# EAGLE schematic DR (EAGLE 9.4.2)

## Sheet 1 of 5
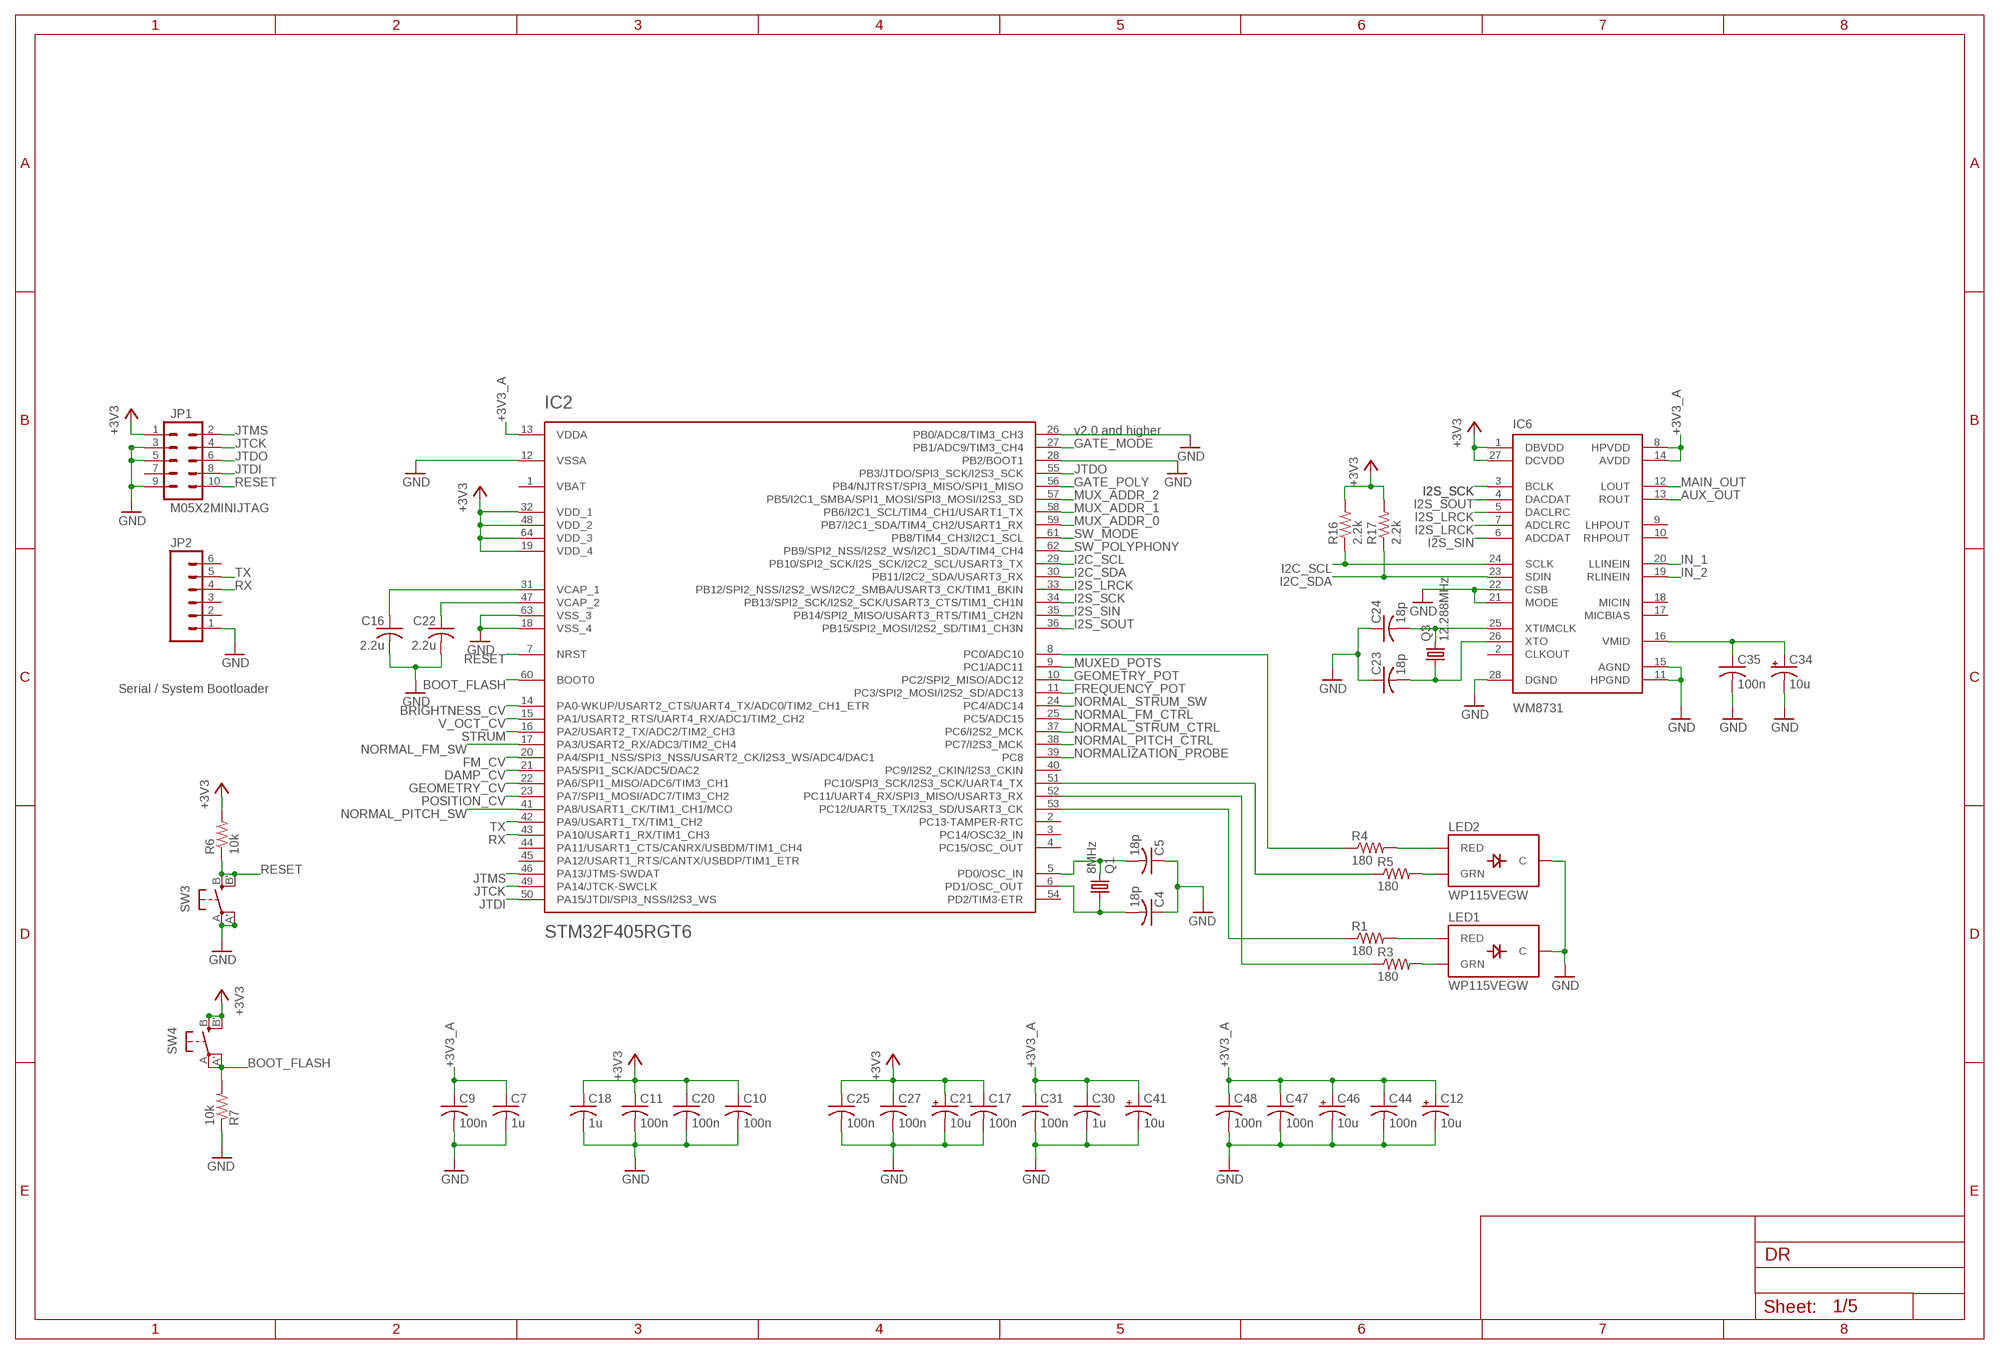
[diagram p0: schematic, sheet 1]

### Parts
C4  18p  C-USC0603  [C0603]
C5  18p  C-USC0603  [C0603]
C7  1u  C-USC0603  [C0603]
C9  100n  C-USC0603  [C0603]
C10  100n  C-USC0603  [C0603]
C11  100n  C-USC0603  [C0603]
C12  10u  CPOL-USA  [PANASONIC_A]
C16  2.2u  C-USC0805  [C0805]
C17  100n  C-USC0603  [C0603]
C18  1u  C-USC0603  [C0603]
C20  100n  C-USC0603  [C0603]
C21  10u  CPOL-USA  [PANASONIC_A]
C22  2.2u  C-USC0805  [C0805]
C23  18p  C-USC0603  [C0603]
C24  18p  C-USC0603  [C0603]
C25  100n  C-USC0603  [C0603]
C27  100n  C-USC0603  [C0603]
C30  1u  C-USC0603  [C0603]
C31  100n  C-USC0603  [C0603]
C34  10u  CPOL-USA  [PANASONIC_A]
C35  100n  C-USC0603  [C0603]
C41  10u  CPOL-USA  [PANASONIC_A]
C44  100n  C-USC0603  [C0603]
C46  10u  CPOL-USA  [PANASONIC_A]
C47  100n  C-USC0603  [C0603]
C48  100n  C-USC0603  [C0603]
IC2  STM32F405RGT6  STM32F20X  [TQFP-10X10-64]
IC6  WM8731  [SSOP28]
JP1  M05X2MINIJTAG  [2X5-1.27]
JP2  M06SIP  [1X06]
LED1  WP115VEGW  LED-BICOLOR-THROUGHHOLE  [LED-BICOLOR-THROUGHHOLE]
LED2  WP115VEGW  LED-BICOLOR-THROUGHHOLE  [LED-BICOLOR-THROUGHHOLE]
Q1  8MHz  CRYSTALHC49UP  [HC49UP]
Q3  12.288MHz  CRYSTALHC49UP  [HC49UP]
R1  180  R-US_R0603  [R0603]
R3  180  R-US_R0603  [R0603]
R4  180  R-US_R0603  [R0603]
R5  180  R-US_R0603  [R0603]
R6  10k  R-US_R0603  [R0603]
R7  10k  R-US_R0603  [R0603]
R16  2.2k  R-US_R0603  [R0603]
R17  2.2k  R-US_R0603  [R0603]
SW3  EVQQ2  [EVQ-Q2]
SW4  EVQQ2  [EVQ-Q2]

### Nets
+3V3: C10.1 C11.1 C17.1 C18.1 C20.1 C21.+ C25.1 C27.1 IC2.19(VDD_4) IC2.32(VDD_1) IC2.48(VDD_2) IC2.64(VDD_3) IC6.1(DBVDD) IC6.27(DCVDD) JP1.1 R6.2 R16.2 R17.2 SW4.B'(S1) SW4.B(S) ; also sheet 2,4,5
+3V3_A: C7.1 C9.1 C12.+ C30.1 C31.1 C41.+ C44.1 C46.+ C47.1 C48.1 IC2.13(VDDA) IC6.8(HPVDD) IC6.14(AVDD) ; also sheet 2,3,4,5
AUX_OUT: IC6.13(ROUT) ; also sheet 4
BOOT_FLASH: IC2.60(BOOT0) R7.2 SW4.A'(P1) SW4.A(P)
BRIGHTNESS_CV: IC2.14(PA0-WKUP/USART2_CTS/UART4_TX/ADC0/TIM2_CH1_ETR) ; also sheet 3
DAMP_CV: IC2.21(PA5/SPI1_SCK/ADC5/DAC2) ; also sheet 3
FM_CV: IC2.20(PA4/SPI1_NSS/SPI3_NSS/USART2_CK/I2S3_WS/ADC4/DAC1) ; also sheet 3
FREQUENCY_POT: IC2.11(PC3/SPI2_MOSI/I2S2_SD/ADC13) ; also sheet 2
GATE_MODE: IC2.27(PB1/ADC9/TIM3_CH4) ; also sheet 2
GATE_POLY: IC2.56(PB4/NJTRST/SPI3_MISO/SPI1_MISO) ; also sheet 2
GEOMETRY_CV: IC2.22(PA6/SPI1_MISO/ADC6/TIM3_CH1) ; also sheet 3
GEOMETRY_POT: IC2.10(PC2/SPI2_MISO/ADC12) ; also sheet 2
GND: C4.1 C5.1 C7.2 C9.2 C10.2 C11.2 C12.- C16.2 C17.2 C18.2 C20.2 C21.- C22.2 C23.1 C24.1 C25.2 C27.2 C30.2 C31.2 C34.- C35.2 C41.- C44.2 C46.- C47.2 C48.2 IC2.12(VSSA) IC2.18(VSS_4) IC2.26(PB0/ADC8/TIM3_CH3) IC2.28(PB2/BOOT1) IC2.63(VSS_3) IC6.11(HPGND) IC6.15(AGND) IC6.21(MODE) IC6.22(CSB) IC6.28(DGND) JP1.3 JP1.5 JP1.9 JP2.1 LED1.2(C) LED2.2(C) R7.1 SW3.A'(P1) SW3.A(P) ; also sheet 2,3,4,5
I2C_SCL: IC2.29(PB10/SPI2_SCK/I2S_SCK/I2C2_SCL/USART3_TX) IC6.24(SCLK) R16.1
I2C_SDA: IC2.30(PB11/I2C2_SDA/USART3_RX) IC6.23(SDIN) R17.1
I2S_LRCK: IC2.33(PB12/SPI2_NSS/I2S2_WS/I2C2_SMBA/USART3_CK/TIM1_BKIN) IC6.5(DACLRC) IC6.7(ADCLRC)
I2S_SCK: IC2.34(PB13/SPI2_SCK/I2S2_SCK/USART3_CTS/TIM1_CH1N) IC6.3(BCLK)
I2S_SIN: IC2.35(PB14/SPI2_MISO/USART3_RTS/TIM1_CH2N) IC6.6(ADCDAT)
I2S_SOUT: IC2.36(PB15/SPI2_MOSI/I2S2_SD/TIM1_CH3N) IC6.4(DACDAT)
IN_1: IC6.20(LLINEIN) ; also sheet 4
IN_2: IC6.19(RLINEIN) ; also sheet 4
JTCK: IC2.49(PA14/JTCK-SWCLK) JP1.4
JTDI: IC2.50(PA15/JTDI/SPI3_NSS/I2S3_WS) JP1.8
JTDO: IC2.55(PB3/JTDO/SPI3_SCK/I2S3_SCK) JP1.6
JTMS: IC2.46(PA13/JTMS-SWDAT) JP1.2
MAIN_OUT: IC6.12(LOUT) ; also sheet 4
MUX_ADDR_0: IC2.59(PB7/I2C1_SDA/TIM4_CH2/USART1_RX) ; also sheet 2
MUX_ADDR_1: IC2.58(PB6/I2C1_SCL/TIM4_CH1/USART1_TX) ; also sheet 2
MUX_ADDR_2: IC2.57(PB5/I2C1_SMBA/SPI1_MOSI/SPI3_MOSI/I2S3_SD) ; also sheet 2
MUXED_POTS: IC2.9(PC1/ADC11) ; also sheet 2
N$7: C5.2 IC2.5(PD0/OSC_IN) Q1.2
N$8: C4.2 IC2.6(PD1/OSC_OUT) Q1.1
N$12: LED1.3(RED) R1.2
N$13: C22.1 IC2.47(VCAP_2)
N$17: C34.+ C35.1 IC6.16(VMID)
N$19: C16.1 IC2.31(VCAP_1)
N$22: LED1.1(GRN) R3.2
N$27: LED2.3(RED) R4.2
N$35: LED2.1(GRN) R5.2
N$37: IC2.52(PC11/UART4_RX/SPI3_MISO/USART3_RX) R3.1
N$40: IC2.8(PC0/ADC10) R4.1
N$41: C24.2 IC6.25(XTI/MCLK) Q3.2
N$42: C23.2 IC6.26(XTO) Q3.1
N$43: IC2.53(PC12/UART5_TX/I2S3_SD/USART3_CK) R1.1
N$44: IC2.51(PC10/SPI3_SCK/I2S3_SCK/UART4_TX) R5.1
NORMAL_FM_CTRL: IC2.25(PC5/ADC15) ; also sheet 4
NORMAL_FM_SW: IC2.17(PA3/USART2_RX/ADC3/TIM2_CH4) ; also sheet 4
NORMAL_PITCH_CTRL: IC2.38(PC7/I2S3_MCK) ; also sheet 4
NORMAL_PITCH_SW: IC2.41(PA8/USART1_CK/TIM1_CH1/MCO) ; also sheet 4
NORMAL_STRUM_CTRL: IC2.37(PC6/I2S2_MCK) ; also sheet 4
NORMAL_STRUM_SW: IC2.24(PC4/ADC14) ; also sheet 4
NORMALIZATION_PROBE: IC2.39(PC8) ; also sheet 4
POSITION_CV: IC2.23(PA7/SPI1_MOSI/ADC7/TIM3_CH2) ; also sheet 3
RESET: IC2.7(NRST) JP1.10 R6.1 SW3.B'(S1) SW3.B(S)
RX: IC2.43(PA10/USART1_RX/TIM1_CH3) JP2.4
STRUM: IC2.16(PA2/USART2_TX/ADC2/TIM2_CH3) ; also sheet 4
SW_MODE: IC2.61(PB8/TIM4_CH3/I2C1_SCL) ; also sheet 2
SW_POLYPHONY: IC2.62(PB9/SPI2_NSS/I2S2_WS/I2C1_SDA/TIM4_CH4) ; also sheet 2
TX: IC2.42(PA9/USART1_TX/TIM1_CH2) JP2.5
V_OCT_CV: IC2.15(PA1/USART2_RTS/UART4_RX/ADC1/TIM2_CH2) ; also sheet 3
Unconnected: IC2.2(PC13-TAMPER-RTC) IC2.3(PC14/OSC32_IN) IC2.4(PC15/OSC_OUT) IC2.40(PC9/I2S2_CKIN/I2S3_CKIN) IC2.44(PA11/USART1_CTS/CANRX/USBDM/TIM1_CH4) IC2.45(PA12/USART1_RTS/CANTX/USBDP/TIM1_ETR) IC2.54(PD2/TIM3-ETR) IC6.2(CLKOUT) IC6.9(LHPOUT) IC6.10(RHPOUT) IC6.17(MICBIAS) IC6.18(MICIN) JP1.7 JP2.2 JP2.3 JP2.6

### Notes on the sheet
- v2.0 and higher
- Serial / System Bootloader

## Sheet 2 of 5
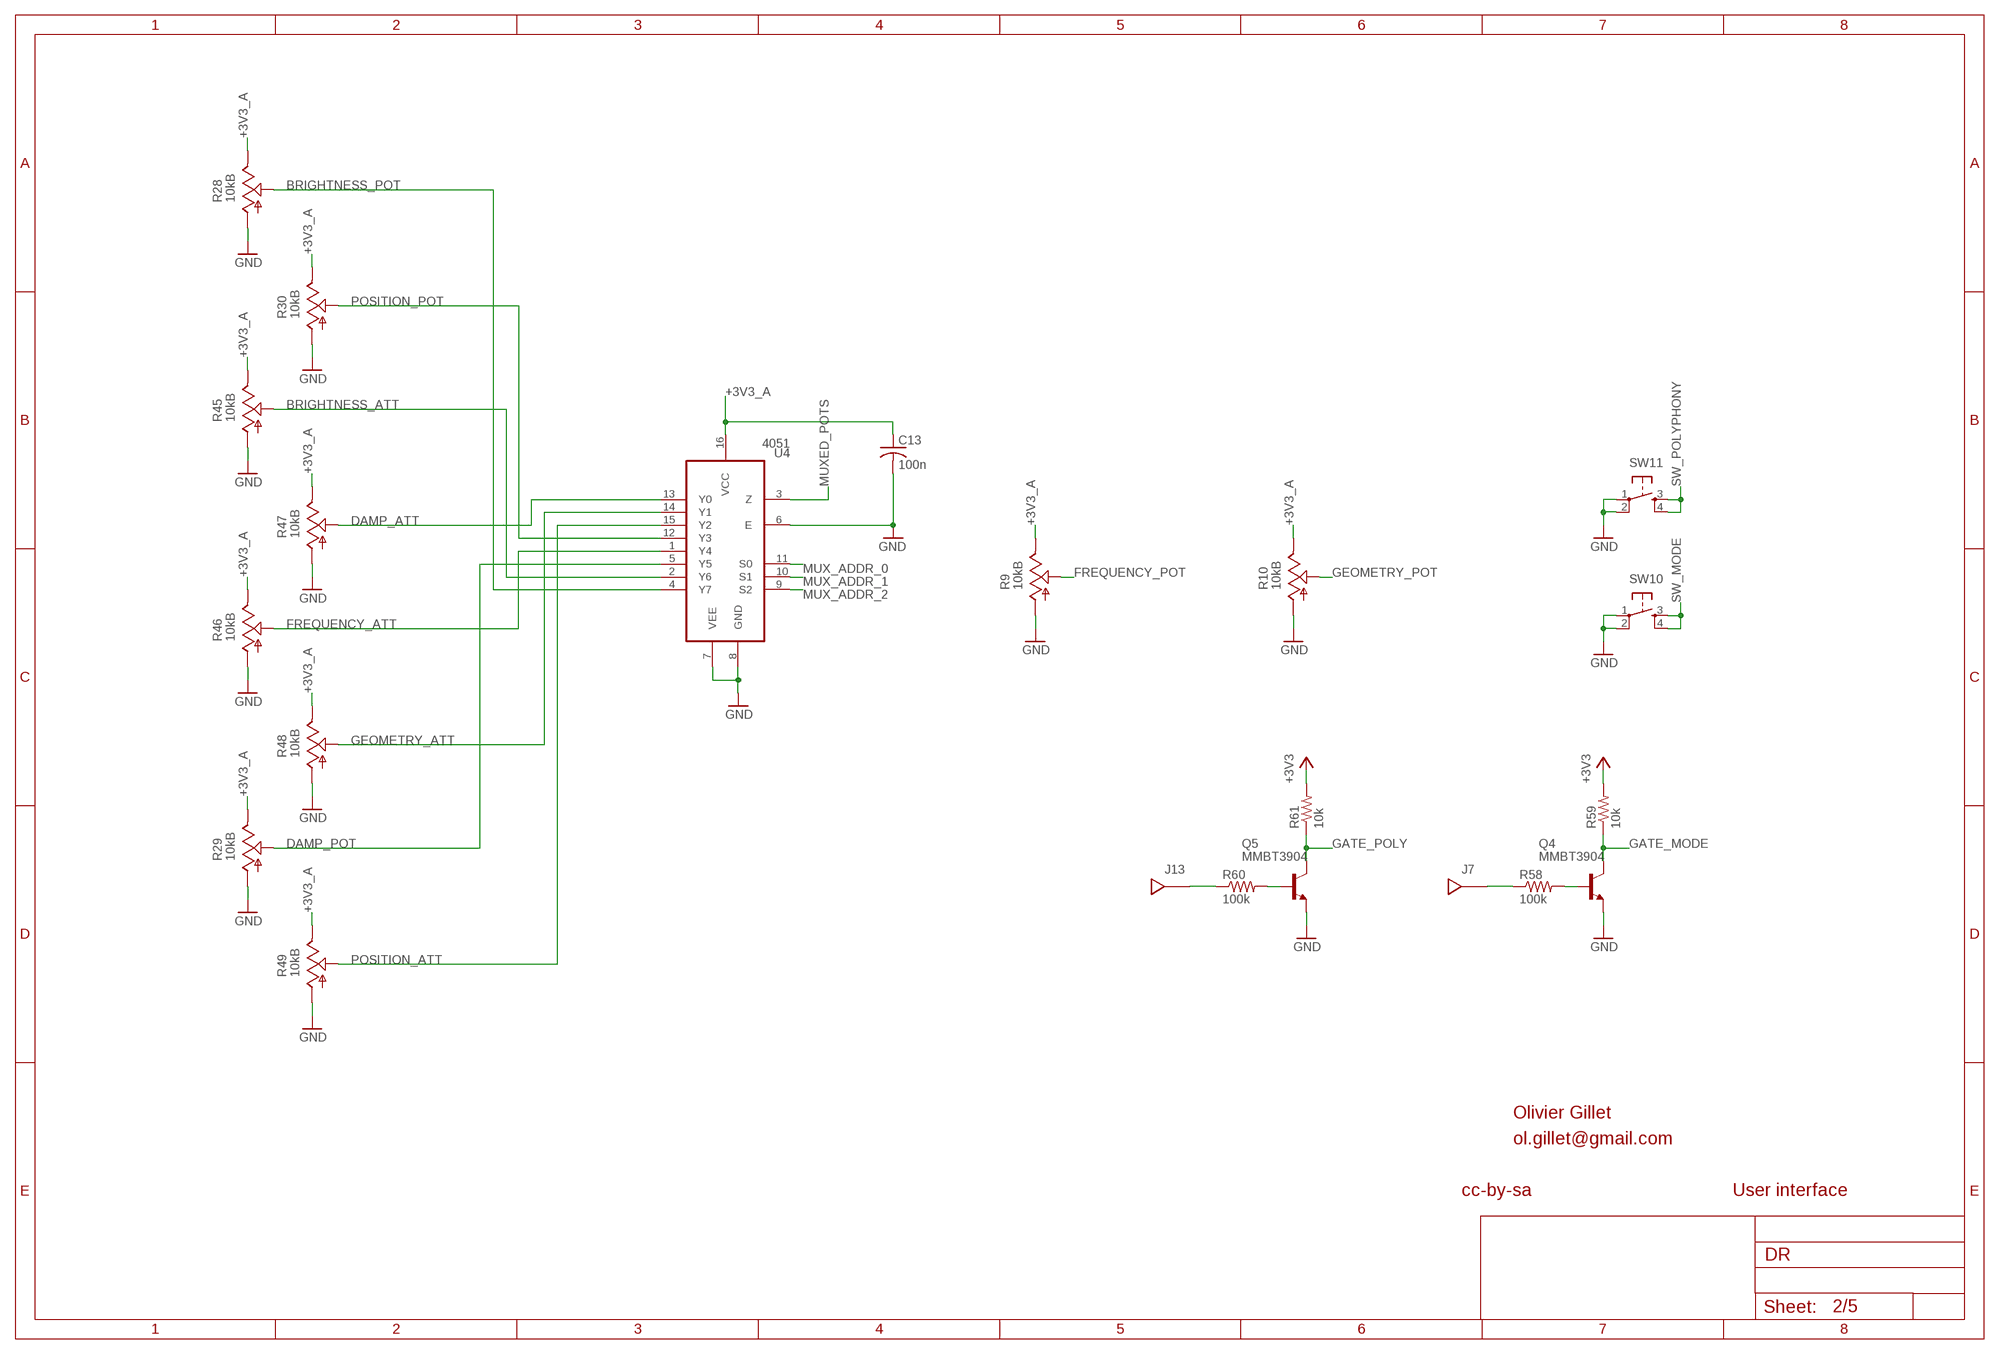
[diagram p1: schematic, sheet 2]

### Parts
C13  100n  C-USC0603  [C0603]
J7  JOHNSON_BANANASTD  [JOHNSON]
J13  JOHNSON_BANANASTD  [JOHNSON]
Q4  MMBT3904  MMBT3904LT1-NPN-SOT23-BEC  [SOT23-BEC]
Q5  MMBT3904  MMBT3904LT1-NPN-SOT23-BEC  [SOT23-BEC]
R9  10kB  POT_USVERTICAL_PS  [ALPS_POT_VERTICAL_PS]
R10  10kB  POT_USVERTICAL_PS  [ALPS_POT_VERTICAL_PS]
R28  10kB  POT_USVERTICAL_PS  [ALPS_POT_VERTICAL_PS]
R29  10kB  POT_USVERTICAL_PS  [ALPS_POT_VERTICAL_PS]
R30  10kB  POT_USVERTICAL_PS  [ALPS_POT_VERTICAL_PS]
R45  10kB  POT_USVERTICAL  [ALPS_POT_VERTICAL]
R46  10kB  POT_USVERTICAL  [ALPS_POT_VERTICAL]
R47  10kB  POT_USVERTICAL  [ALPS_POT_VERTICAL]
R48  10kB  POT_USVERTICAL  [ALPS_POT_VERTICAL]
R49  10kB  POT_USVERTICAL  [ALPS_POT_VERTICAL]
R58  100k  R-US_R0603  [R0603]
R59  10k  R-US_R0603  [R0603]
R60  100k  R-US_R0603  [R0603]
R61  10k  R-US_R0603  [R0603]
SW10  TAC_SWITCH  [C&K_D6R]
SW11  TAC_SWITCH  [C&K_D6R]
U4  4051  [SO16]

### Nets
+3V3: R59.2 R61.2 ; also sheet 1,4,5
+3V3_A: C13.1 R9.P$1(E) R10.P$1(E) R28.P$1(E) R29.P$1(E) R30.P$1(E) R45.P$1(E) R46.P$1(E) R47.P$1(E) R48.P$1(E) R49.P$1(E) U4.16(VCC) ; also sheet 1,3,4,5
BRIGHTNESS_ATT: R45.P$2(S) U4.2(Y6)
BRIGHTNESS_POT: R28.P$2(S) U4.4(Y7)
DAMP_ATT: R47.P$2(S) U4.13(Y0)
DAMP_POT: R29.P$2(S) U4.5(Y5)
FREQUENCY_ATT: R46.P$2(S) U4.1(Y4)
FREQUENCY_POT: R9.P$2(S) ; also sheet 1
GATE_MODE: Q4.C R59.1 ; also sheet 1
GATE_POLY: Q5.C R61.1 ; also sheet 1
GEOMETRY_ATT: R48.P$2(S) U4.14(Y1)
GEOMETRY_POT: R10.P$2(S) ; also sheet 1
GND: C13.2 Q4.E Q5.E R9.P$3(A) R10.P$3(A) R28.P$3(A) R29.P$3(A) R30.P$3(A) R45.P$3(A) R46.P$3(A) R47.P$3(A) R48.P$3(A) R49.P$3(A) SW10.1 SW10.2 SW11.1 SW11.2 U4.6(E) U4.7(VEE) U4.8(GND) ; also sheet 1,3,4,5
MUX_ADDR_0: U4.11(S0) ; also sheet 1
MUX_ADDR_1: U4.10(S1) ; also sheet 1
MUX_ADDR_2: U4.9(S2) ; also sheet 1
MUXED_POTS: U4.3(Z) ; also sheet 1
N$3: Q4.B R58.2
N$4: Q5.B R60.2
N$9: J7.1 R58.1
N$20: J13.1 R60.1
POSITION_ATT: R49.P$2(S) U4.15(Y2)
POSITION_POT: R30.P$2(S) U4.12(Y3)
SW_MODE: SW10.3 SW10.4 ; also sheet 1
SW_POLYPHONY: SW11.3 SW11.4 ; also sheet 1

### Notes on the sheet
- Olivier Gillet
- ol.gillet@gmail.com
- cc-by-sa | User interface

## Sheet 3 of 5
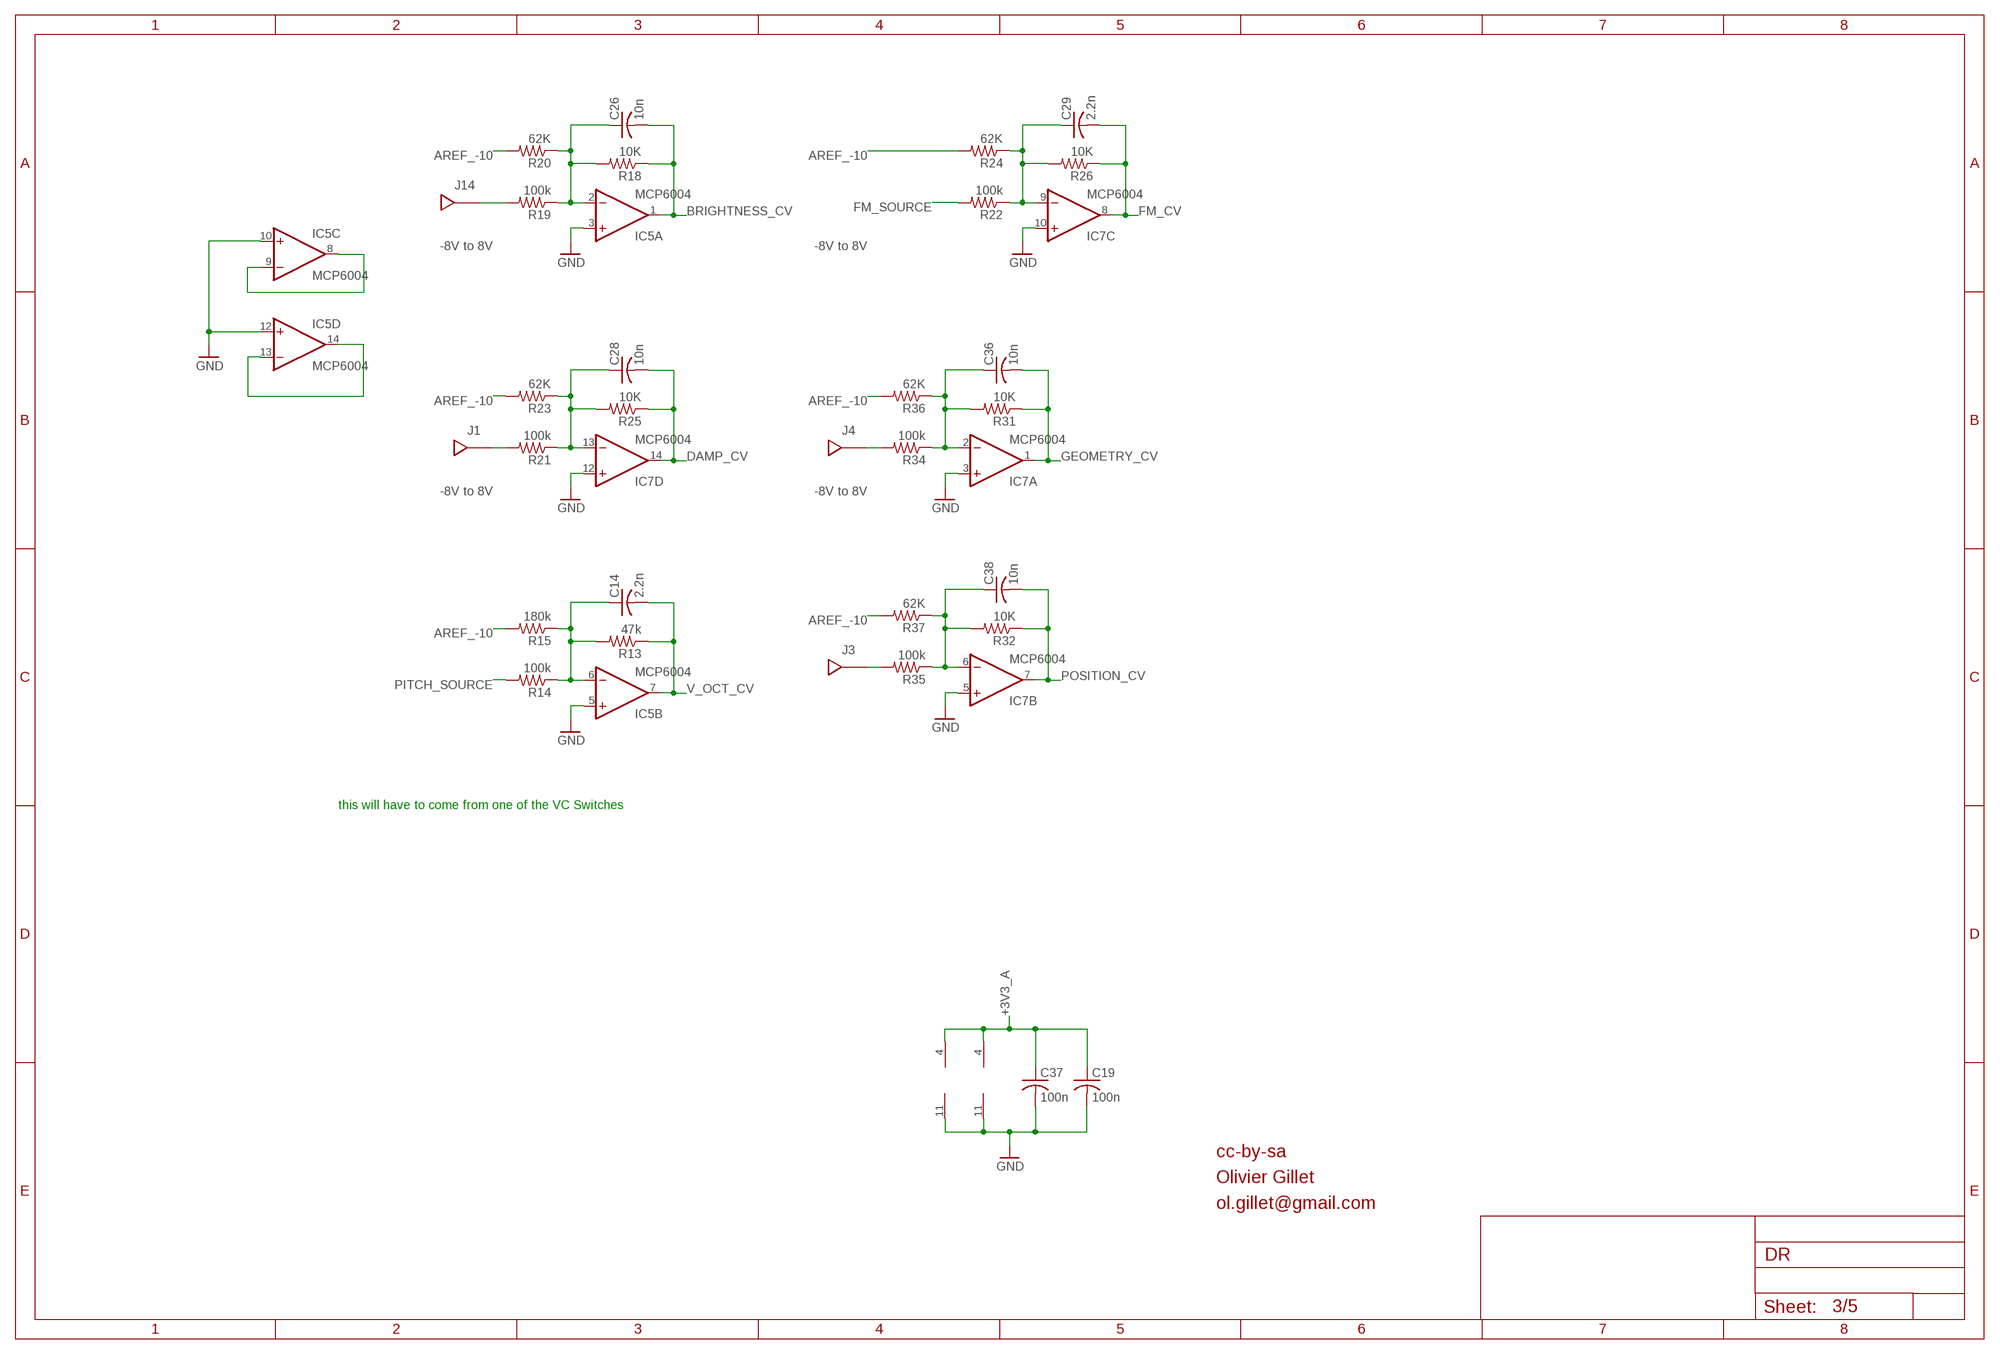
[diagram p2: schematic, sheet 3]

### Parts
C14  2.2n  C-USC0603  [C0603]
C19  100n  C-USC0603  [C0603]
C26  10n  C-USC0603  [C0603]
C28  10n  C-USC0603  [C0603]
C29  2.2n  C-USC0603  [C0603]
C36  10n  C-USC0603  [C0603]
C37  100n  C-USC0603  [C0603]
C38  10n  C-USC0603  [C0603]
IC5  MCP6004  QUAD_OPAMPD  [SO14]
IC7  MCP6004  QUAD_OPAMPD  [SO14]
J1  JOHNSON_BANANASTD  [JOHNSON]
J3  JOHNSON_BANANASTD  [JOHNSON]
J4  JOHNSON_BANANASTD  [JOHNSON]
J14  JOHNSON_BANANASTD  [JOHNSON]
R13  47k  R-US_R0603  [R0603]
R14  100k  R-US_R0603  [R0603]
R15  180k  R-US_R0603  [R0603]
R18  10K  R-US_R0603  [R0603]
R19  100k  R-US_R0603  [R0603]
R20  62K  R-US_R0603  [R0603]
R21  100k  R-US_R0603  [R0603]
R22  100k  R-US_R0603  [R0603]
R23  62K  R-US_R0603  [R0603]
R24  62K  R-US_R0603  [R0603]
R25  10K  R-US_R0603  [R0603]
R26  10K  R-US_R0603  [R0603]
R31  10K  R-US_R0603  [R0603]
R32  10K  R-US_R0603  [R0603]
R34  100k  R-US_R0603  [R0603]
R35  100k  R-US_R0603  [R0603]
R36  62K  R-US_R0603  [R0603]
R37  62K  R-US_R0603  [R0603]

### Nets
+3V3_A: C19.1 C37.1 IC5.4(P:V+) IC7.4(P:V+) ; also sheet 1,2,4,5
AREF_-10: R15.2 R20.2 R23.2 R24.2 R36.2 R37.2 ; also sheet 5
BRIGHTNESS_CV: C26.2 IC5.1(A:OUT) R18.1 ; also sheet 1
DAMP_CV: C28.2 IC7.14(D:OUT) R25.1 ; also sheet 1
FM_CV: C29.2 IC7.8(C:OUT) R26.1 ; also sheet 1
FM_SOURCE: R22.2 ; also sheet 4
GEOMETRY_CV: C36.2 IC7.1(A:OUT) R31.1 ; also sheet 1
GND: C19.2 C37.2 IC5.3(A:+IN) IC5.5(B:+IN) IC5.10(C:+IN) IC5.11(P:V-) IC5.12(D:+IN) IC7.3(A:+IN) IC7.5(B:+IN) IC7.10(C:+IN) IC7.11(P:V-) IC7.12(D:+IN) ; also sheet 1,2,4,5
N$1: J14.1 R19.2
N$2: C26.1 IC5.2(A:-IN) R18.2 R19.1 R20.1
N$5: C29.1 IC7.9(C:-IN) R22.1 R24.1 R26.2
N$6: J4.1 R34.2
N$10: J1.1 R21.2
N$11: C28.1 IC7.13(D:-IN) R21.1 R23.1 R25.2
N$14: C14.1 IC5.6(B:-IN) R13.2 R14.1 R15.1
N$15: C36.1 IC7.2(A:-IN) R31.2 R34.1 R36.1
N$26: J3.1 R35.2
N$30: C38.1 IC7.6(B:-IN) R32.2 R35.1 R37.1
N$57: IC5.13(D:-IN) IC5.14(D:OUT)
N$58: IC5.8(C:OUT) IC5.9(C:-IN)
PITCH_SOURCE: R14.2 ; also sheet 4
POSITION_CV: C38.2 IC7.7(B:OUT) R32.1 ; also sheet 1
V_OCT_CV: C14.2 IC5.7(B:OUT) R13.1 ; also sheet 1

### Notes on the sheet
- -8V to 8V | -8V to 8V
- -8V to 8V | -8V to 8V
- this will have to come from one of the VC Switches
- cc-by-sa
- Olivier Gillet
- ol.gillet@gmail.com

## Sheet 4 of 5
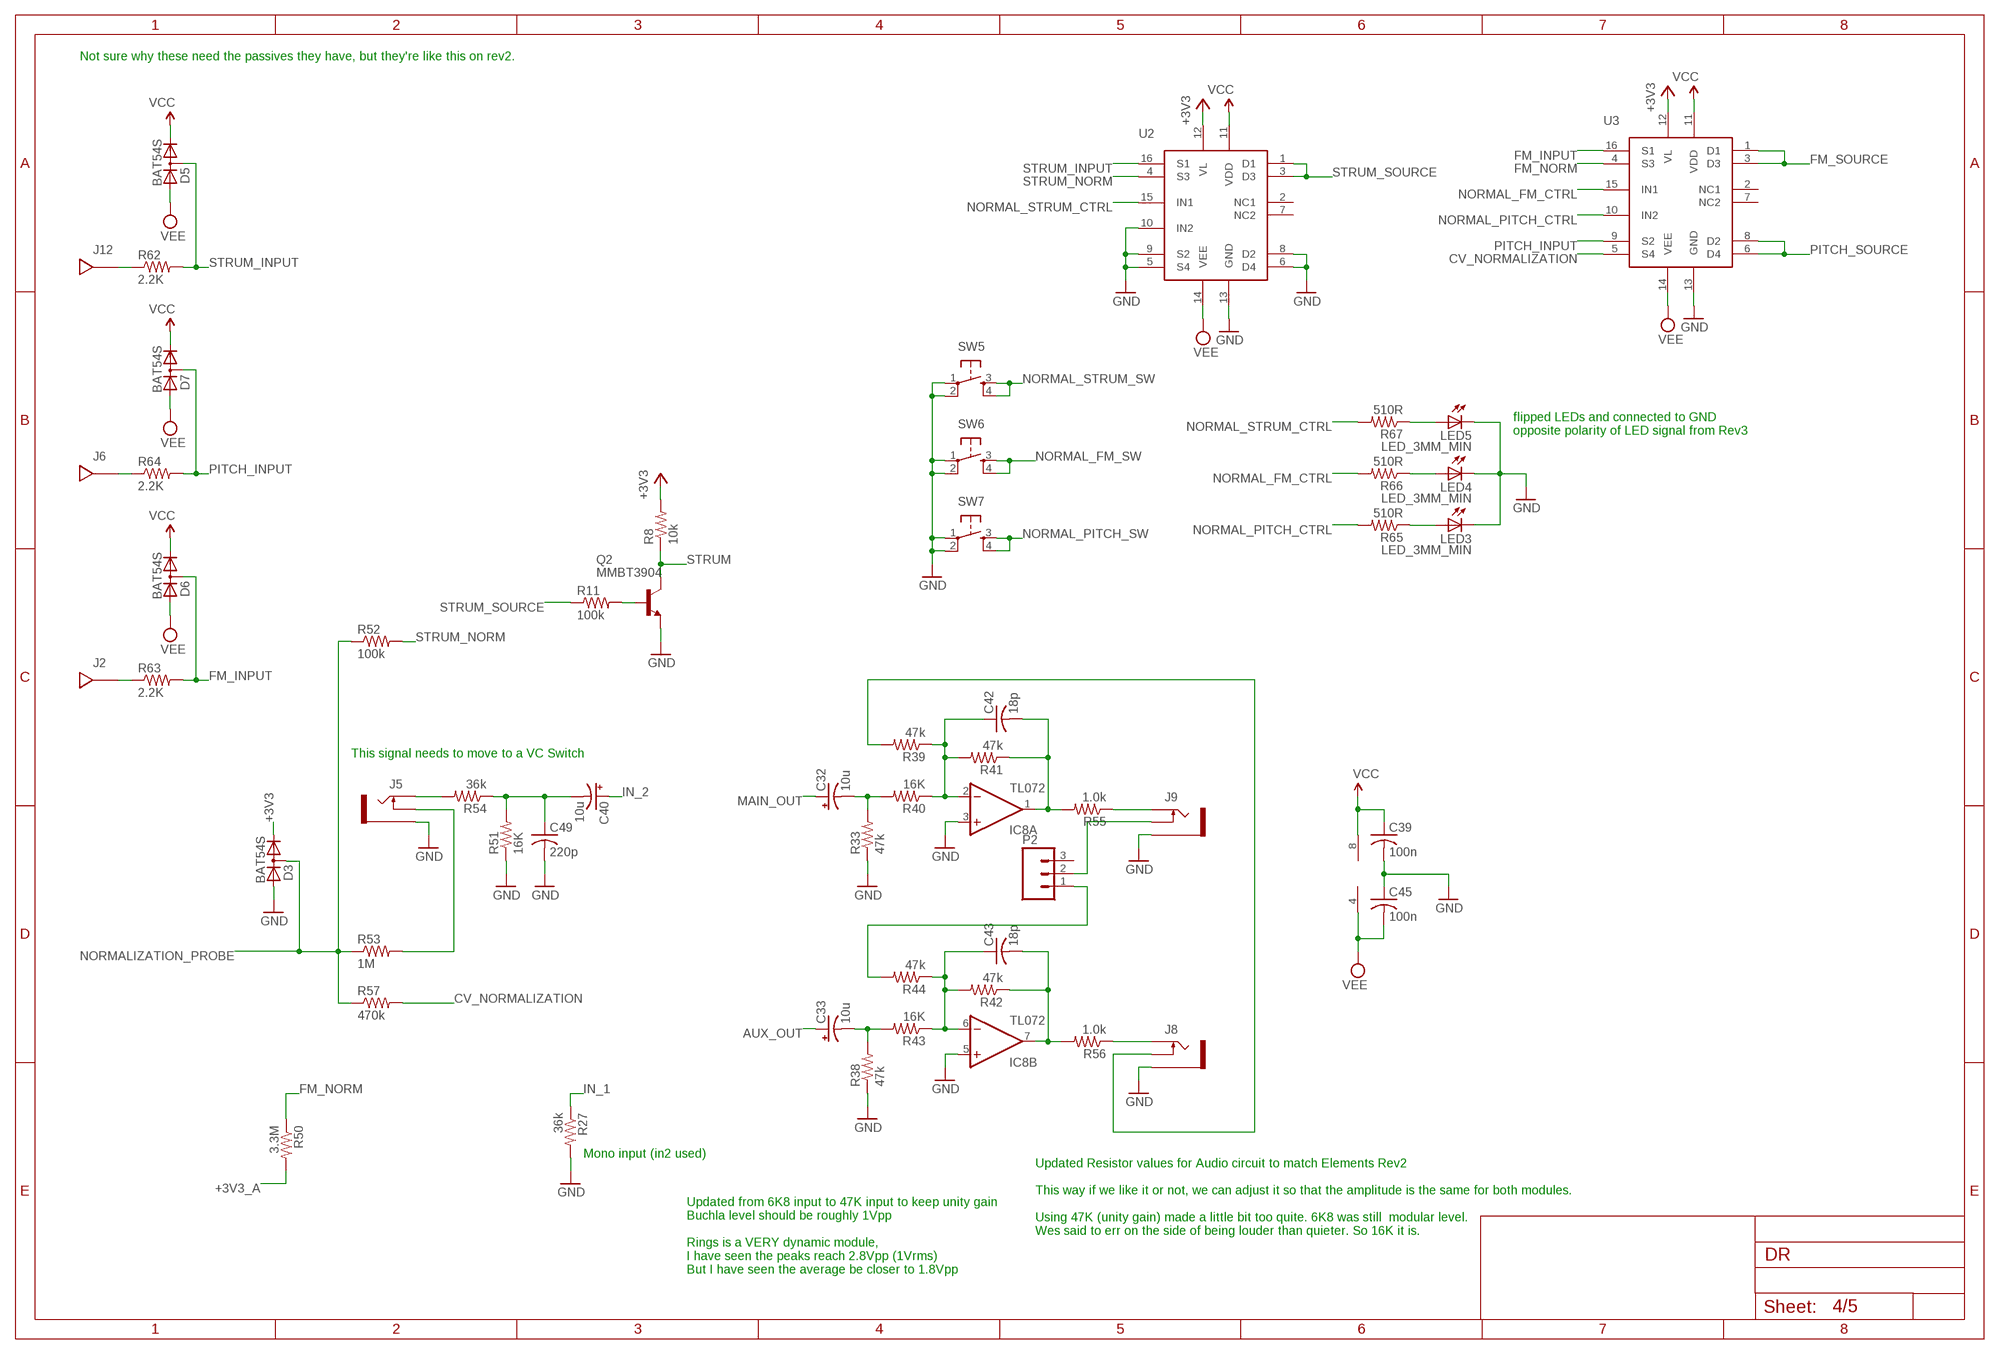
[diagram p3: schematic, sheet 4]

### Parts
C32  10u  CPOL-USA  [PANASONIC_A]
C33  10u  CPOL-USA  [PANASONIC_A]
C39  100n  C-USC0603  [C0603]
C40  10u  CPOL-USA  [PANASONIC_A]
C42  18p  C-USC0603  [C0603]
C43  18p  C-USC0603  [C0603]
C45  100n  C-USC0603  [C0603]
C49  220p  C-USC0603  [C0603]
D3  BAT54S  DIODE_2CACA-SOT23  [SOT23]
D5  BAT54S  DIODE_2CACA-SOT23  [SOT23]
D6  BAT54S  DIODE_2CACA-SOT23  [SOT23]
D7  BAT54S  DIODE_2CACA-SOT23  [SOT23]
IC8  TL072  TL072D  [SO08]
J2  JOHNSON_BANANASTD  [JOHNSON]
J5  SWITCHCRAFT_42A  [SWITCH_JOHNSON]
J6  JOHNSON_BANANASTD  [JOHNSON]
J8  SWITCHCRAFT_42A  [SWITCH_JOHNSON]
J9  SWITCHCRAFT_42A  [SWITCH_JOHNSON]
J12  JOHNSON_BANANASTD  [JOHNSON]
LED3  LED_3MM_MIN  [LED_3MM_MIN]
LED4  LED_3MM_MIN  [LED_3MM_MIN]
LED5  LED_3MM_MIN  [LED_3MM_MIN]
P2  M03LOCK  [1X03_LOCK]
Q2  MMBT3904  MMBT3904LT1-NPN-SOT23-BEC  [SOT23-BEC]
R8  10k  R-US_R0603  [R0603]
R11  100k  R-US_R0603  [R0603]
R27  36k  R-US_R0603  [R0603]
R33  47k  R-US_R0603  [R0603]
R38  47k  R-US_R0603  [R0603]
R39  47k  R-US_R0603  [R0603]
R40  16K  R-US_R0603  [R0603]
R41  47k  R-US_R0603  [R0603]
R42  47k  R-US_R0603  [R0603]
R43  16K  R-US_R0603  [R0603]
R44  47k  R-US_R0603  [R0603]
R50  3.3M  R-US_R0603  [R0603]
R51  16K  R-US_R0603  [R0603]
R52  100k  R-US_R0603  [R0603]
R53  1M  R-US_R0603  [R0603]
R54  36k  R-US_R0603  [R0603]
R55  1.0k  R-US_R0603  [R0603]
R56  1.0k  R-US_R0603  [R0603]
R57  470k  R-US_R0603  [R0603]
R62  2.2K  R-US_R0603  [R0603]
R63  2.2K  R-US_R0603  [R0603]
R64  2.2K  R-US_R0603  [R0603]
R65  510R  R-US_R0603  [R0603]
R66  510R  R-US_R0603  [R0603]
R67  510R  R-US_R0603  [R0603]
SW5  TAC_SWITCHPTH  [TACTILE-PTH]
SW6  TAC_SWITCHPTH  [TACTILE-PTH]
SW7  TAC_SWITCHPTH  [TACTILE-PTH]
U2  DG403_ANALOG_SWITCH  [SO16]
U3  DG403_ANALOG_SWITCH  [SO16]

### Nets
+3V3: D3.2(C) R8.2 U2.12(VL) U3.12(VL) ; also sheet 1,2,5
+3V3_A: R50.2 ; also sheet 1,2,3,5
AUX_OUT: C33.+ ; also sheet 1
CV_NORMALIZATION: R57.2 U3.5(S4)
FM_INPUT: D6.3(AC) R63.2 U3.16(S1)
FM_NORM: R50.1 U3.4(S3)
FM_SOURCE: U3.1(D1) U3.3(D3) ; also sheet 3
GND: C39.2 C45.1 C49.2 D3.1(A) IC8.3(A:+IN) IC8.5(B:+IN) J5.G J8.G J9.G LED3.K(C) LED4.K(C) LED5.K(C) Q2.E R27.2 R33.1 R38.1 R51.1 SW5.1 SW5.2 SW6.1 SW6.2 SW7.1 SW7.2 U2.5(S4) U2.6(D4) U2.8(D2) U2.9(S2) U2.10(IN2) U2.13(GND) U3.13(GND) ; also sheet 1,2,3,5
IN_1: R27.1 ; also sheet 1
IN_2: C40.+ ; also sheet 1
MAIN_OUT: C32.+ ; also sheet 1
N$18: C40.- C49.1 R51.2 R54.1
N$21: J5.S R54.2
N$23: C33.- R38.2 R43.2
N$24: LED5.A R67.1
N$25: C43.1 IC8.6(B:-IN) R42.2 R43.1 R44.1
N$28: C43.2 IC8.7(B:OUT) R42.1 R56.2
N$29: J8.S R56.1
N$31: C32.- R33.2 R40.2
N$32: C42.1 IC8.2(A:-IN) R39.1 R40.1 R41.2
N$33: C42.2 IC8.1(A:OUT) R41.1 R55.2
N$34: J9.S R55.1
N$36: LED4.A R66.1
N$38: J12.1 R62.1
N$39: J5.C R53.2
N$45: J8.C R39.2
N$46: P2.1 R44.2
N$47: J9.C P2.2
N$51: LED3.A R65.1
N$52: J2.1 R63.1
N$53: J6.1 R64.1
N$66: Q2.B R11.2
NORMAL_FM_CTRL: R66.2 U3.15(IN1) ; also sheet 1
NORMAL_FM_SW: SW6.3 SW6.4 ; also sheet 1
NORMAL_PITCH_CTRL: R65.2 U3.10(IN2) ; also sheet 1
NORMAL_PITCH_SW: SW7.3 SW7.4 ; also sheet 1
NORMAL_STRUM_CTRL: R67.2 U2.15(IN1) ; also sheet 1
NORMAL_STRUM_SW: SW5.3 SW5.4 ; also sheet 1
NORMALIZATION_PROBE: D3.3(AC) R52.1 R53.1 R57.1 ; also sheet 1
PITCH_INPUT: D7.3(AC) R64.2 U3.9(S2)
PITCH_SOURCE: U3.6(D4) U3.8(D2) ; also sheet 3
STRUM: Q2.C R8.1 ; also sheet 1
STRUM_INPUT: D5.3(AC) R62.2 U2.16(S1)
STRUM_NORM: R52.2 U2.4(S3)
STRUM_SOURCE: R11.1 U2.1(D1) U2.3(D3)
VCC: C39.1 D5.2(C) D6.2(C) D7.2(C) IC8.8(P:V+) U2.11(VDD) U3.11(VDD) ; also sheet 5
VEE: C45.2 D5.1(A) D6.1(A) D7.1(A) IC8.4(P:V-) U2.14(VEE) U3.14(VEE) ; also sheet 5
Unconnected: P2.3 U2.2(NC1) U2.7(NC2) U3.2(NC1) U3.7(NC2)

### Notes on the sheet
- Not sure why these need the passives they have, but they're like this on rev2.
- flipped LEDs and connected to GND
  opposite polarity of LED signal from Rev3
- This signal needs to move to a VC Switch
- Mono input (in2 used)
- Updated Resistor values for Audio circuit to match Elements Rev2
  
  This way if we like it or not, we can adjust it so that the amplitude is the same for both modules.
  
  Using 47K (unity gain) made a little bit too quite. 6K8 was still  modular level.
  Wes said to err on the side of being louder than quieter. So 16K it is.
- Updated from 6K8 input to 47K input to keep unity gain
  Buchla level should be roughly 1Vpp
  
  Rings is a VERY dynamic module,
  I have seen the peaks reach 2.8Vpp (1Vrms)
  But I have seen the average be closer to 1.8Vpp

## Sheet 5 of 5
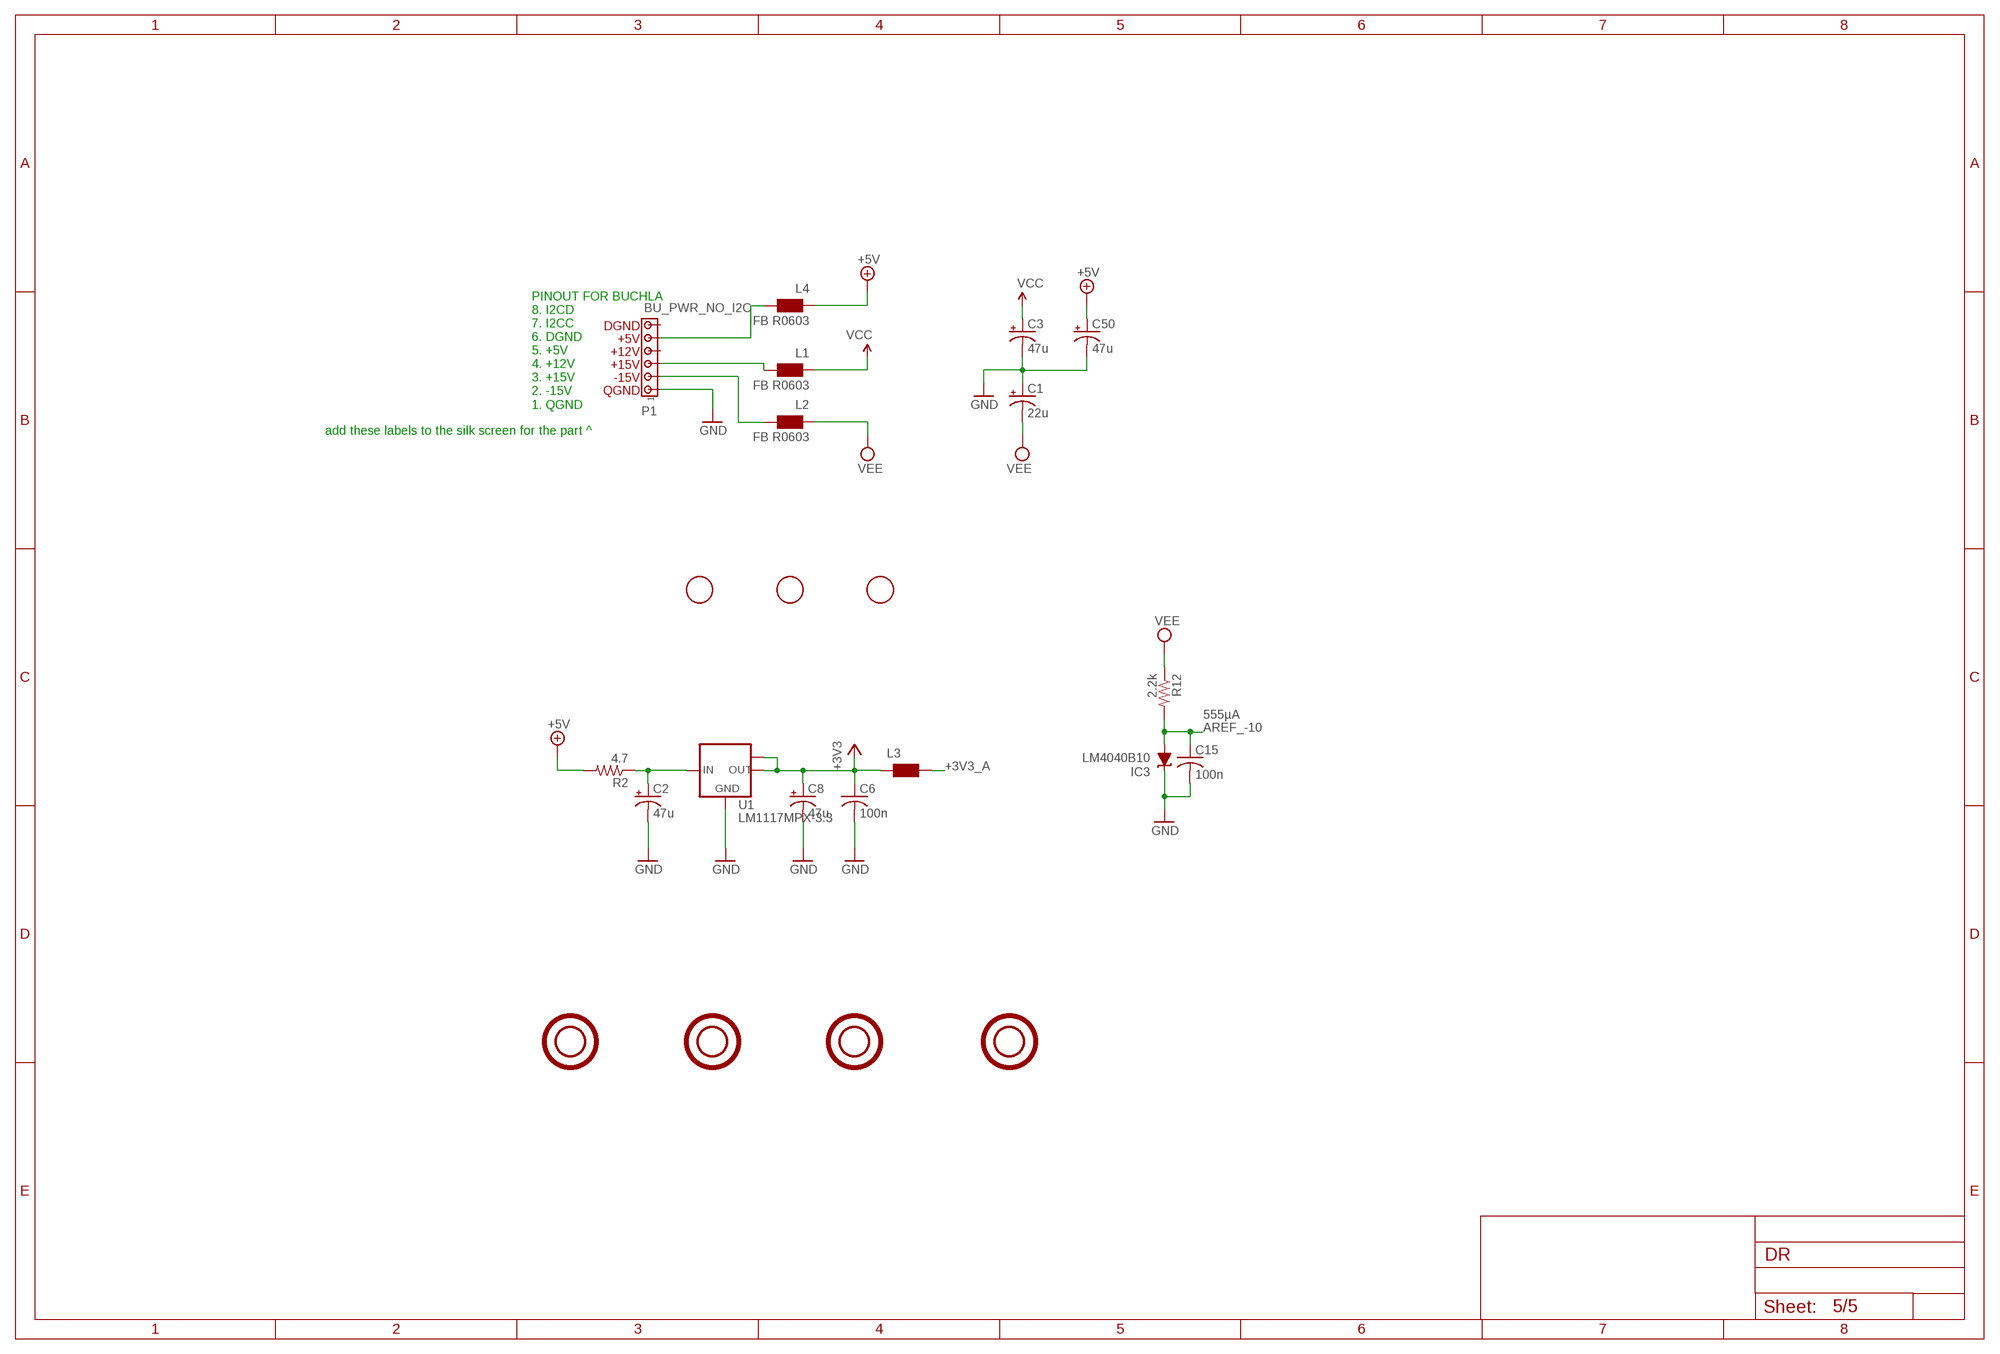
[diagram p4: schematic, sheet 5]

### Parts
C1  22u  CPOL-USC  [PANASONIC_C]
C2  47u  CPOL-USD  [PANASONIC_D]
C3  47u  CPOL-USD  [PANASONIC_D]
C6  100n  C-USC0603  [C0603]
C8  47u  CPOL-USD  [PANASONIC_D]
C15  100n  C-USC0603  [C0603]
C50  47u  CPOL-USD  [PANASONIC_D]
FD1  FIDUCIAL  [FIDUCIAL_1MM]
FD2  FIDUCIAL  [FIDUCIAL_1MM]
FD3  FIDUCIAL  [FIDUCIAL_1MM]
H1  3MM_MOUNT_HOLE  [3,0-PAD]
H2  3MM_MOUNT_HOLE  [3,0-PAD]
H3  3MM_MOUNT_HOLE  [3,0-PAD]
H4  3MM_MOUNT_HOLE  [3,0-PAD]
IC3  LM4040B10  LM4041B12DBZ  [DBZ_R-PDSO-G3]
L1  FB R0603  WE-CBF_0603  [0603]
L2  FB R0603  WE-CBF_0603  [0603]
L3  WE-CBF_0603  [0603]
L4  FB R0603  WE-CBF_0603  [0603]
P1  BU_PWR_NO_I2C  [MTA_156]
R2  4.7  R-US_R1206  [R1206]
R12  2.2k  R-US_R0603  [R0603]
U1  LM1117MPX-3.3  [SOT223]

### Nets
+3V3: C6.1 C8.+ L3.1 U1.2(OUT) U1.TAB(OUT1) ; also sheet 1,2,4
+3V3_A: L3.2 ; also sheet 1,2,3,4
+5V: C50.+ L4.1 R2.2
AREF_-10: C15.1 IC3.2(A) R12.2 ; also sheet 3
GND: C1.+ C2.- C3.- C6.2 C8.- C15.2 C50.- IC3.1(C) P1.1 U1.1(GND) ; also sheet 1,2,3,4
N$16: C2.+ R2.1 U1.3(IN)
N$48: L2.2 P1.2
N$49: L4.2 P1.5
N$50: L1.2 P1.3
VCC: C3.+ L1.1 ; also sheet 4
VEE: C1.- L2.1 R12.1 ; also sheet 4
Unconnected: P1.4 P1.6

### Notes on the sheet
- PINOUT FOR BUCHLA
  8. I2CD
  7. I2CC
  6. DGND
  5. +5V
  4. +12V
  3. +15V
  2. -15V
  1. QGND
- add these labels to the silk screen for the part ^
- 555µA

## Power pins joined to a net without a drawn wire
VBAT: IC2.1(VBAT)

## Library data of the parts
C1-C3 C8 C12 C21 C32-C34 C40 C41 C46 C50 = rcl:CPOL-US: POLARIZED CAPACITOR, American symbol
C4-C7 C9-C11 C13-C20 C22-C31 C35-C39 C42-C45 C47-C49 = rcl:C-US: CAPACITOR, American symbol
D3 D5-D7 = diode:DIODE_2CACA-: 2 Diodes - Cathode-Anode|Cathode-Anode
FD1-FD3 = 2hp_Audio_BB_Rev4:FIDUCIAL: For use by pick and place machines to calibrate the vision/machine, 1mm By microbuilder.eu
H1-H4 = Electrosmith-Connectors:3MM_MOUNT_HOLE
IC2 = og-stm32f2:STM32F20X
IC3 = texas:LM4041: PRECISION MICROPOWER SHUNT VOLTAGE REFERENCE Source: http://focus.ti.com/lit/ds/slcs146e/slcs146e.pdf
IC5 IC7 = Electrosmith-Misc:QUAD_OPAMP: OP AMP
IC6 = og-dac:WM8731
IC8 = og-linear:TL072: OP AMP
J1-J4 J6 J7 J12-J14 = og-pj301:JOHNSON_BANANA
J5 J8 J9 = ElectroSmith:SWITCHCRAFT_42A
JP1 = Electrosmith-Connectors:M05X2: Header 5x2 Standard 10-pin dual row 0.1" header. Commonly used with AVR-ISP. Use with Spark Fun Electronics SKU: PRT-00778
JP2 = SparkFun:M06: Header 6 Standard 6-pin 0.1" header. Use with straight break away headers (SKU : PRT-00116), right angle break away headers (PRT-00553), swiss pins (PRT-00743), machine pins (PRT-00117), and female headers (PRT-00115). Molex polarized connector foot print use with SKU : PRT-08094 with associated crimp pins and housings. NOTES ON THE VARIANTS LOCK and LOCK_LONGPADS... This footprint was designed to help hold the alignment of a through-hole component (i.e. 6-pin header) while soldering it into place. You may notice that each hole has been shifted either up or down by 0.005 of an inch from it's more standard position (which is a perfectly straight line). This slight alteration caused the pins (the squares in the middle) to touch the edges of the holes. Because they are alternating, it causes a "brace" to hold the component in place. 0.005 has proven to be the perfect amount of "off-center" position when using our standard breakaway headers. Although looks a little odd when you look at the bare footprint, once you have a header in there, the alteration is very hard to notice. Also, if you push a header all the way into place, it is covered up entirely on the bottom side. This idea of altering the position of holes to aid alignment will be further integrated into the Sparkfun Library for other footprints. It can help hold any component with 3 or more connection pins.
L1-L4 = wuerth-elektronik:WE-CBF: SMD EMI Suppression Ferrite Beads - excellent anti-EMI properties - low DCR - impedances till 3000 ohms - rated current up to 6 A
LED1 LED2 = og-leds:LED-BICOLOR-THROUGHHOLE
LED3-LED5 = AndrewIkenberry:LED_3MM_MIN
P1 = Electrosmith-Connectors:BU_PWR_NO_I2C; 12V: +12V; 5V: +5V; DGND: DGND; PIN1_LABEL: 1; QGND: QGND; VCC: +15V; VEE: -15V
P2 = Electrosmith-Connectors:M03: Header 3 Standard 3-pin 0.1" header. Use with straight break away headers (SKU : PRT-00116), right angle break away headers (PRT-00553), swiss pins (PRT-00743), machine pins (PRT-00117), and female headers (PRT-00115). Molex polarized connector foot print use with SKU : PRT-08232 with associated crimp pins and housings.
Q1 Q3 = crystal:CRYSTAL: CRYSTAL
Q2 Q4 Q5 = transistor:*-NPN-: NPN Transistror BF959 corrected 2008.03.06
R1-R8 R11-R27 R31-R44 R50-R67 = rcl:R-US_: RESISTOR, American symbol
R9 R10 R28-R30 R45-R49 = og-pots:POT_US
SW3 SW4 = adafruit:EVQQ2: SMT 6mm switch, EVQQ2 series http://www.ladyada.net/library/eagle
SW5-SW7 SW10 SW11 = SparkFun:TAC_SWITCH: Momentary Switch Button commonly used for reset or general input. Spark Fun Electronics SKU : COM-00097
U1 = Electrosmith-Misc:LM1117MPX-*
U2 U3 = Electrosmith-Misc:DG403_ANALOG_SWITCH: Analog Switch 2x SPDT (Single and Dual Supply support) datasheet <https://www.intersil.com/content/dam/Intersil/documents/dg40/dg401-03.pdf> Mouser <https://www.mouser.com/ProductDetail/Renesas-Intersil/DG403DYZ?qs=sGAEpiMZZMtxrAS98ir%252bs5qoksOmsfvm6MqZoR8YFts%3d>
U4 = Electrosmith-Misc:4051

## Net classes
0 default: width 0.203 mm